# Altium schematic sheet Connectors.SchDoc
size B; SheetNumber: 2; SheetTotal: 2
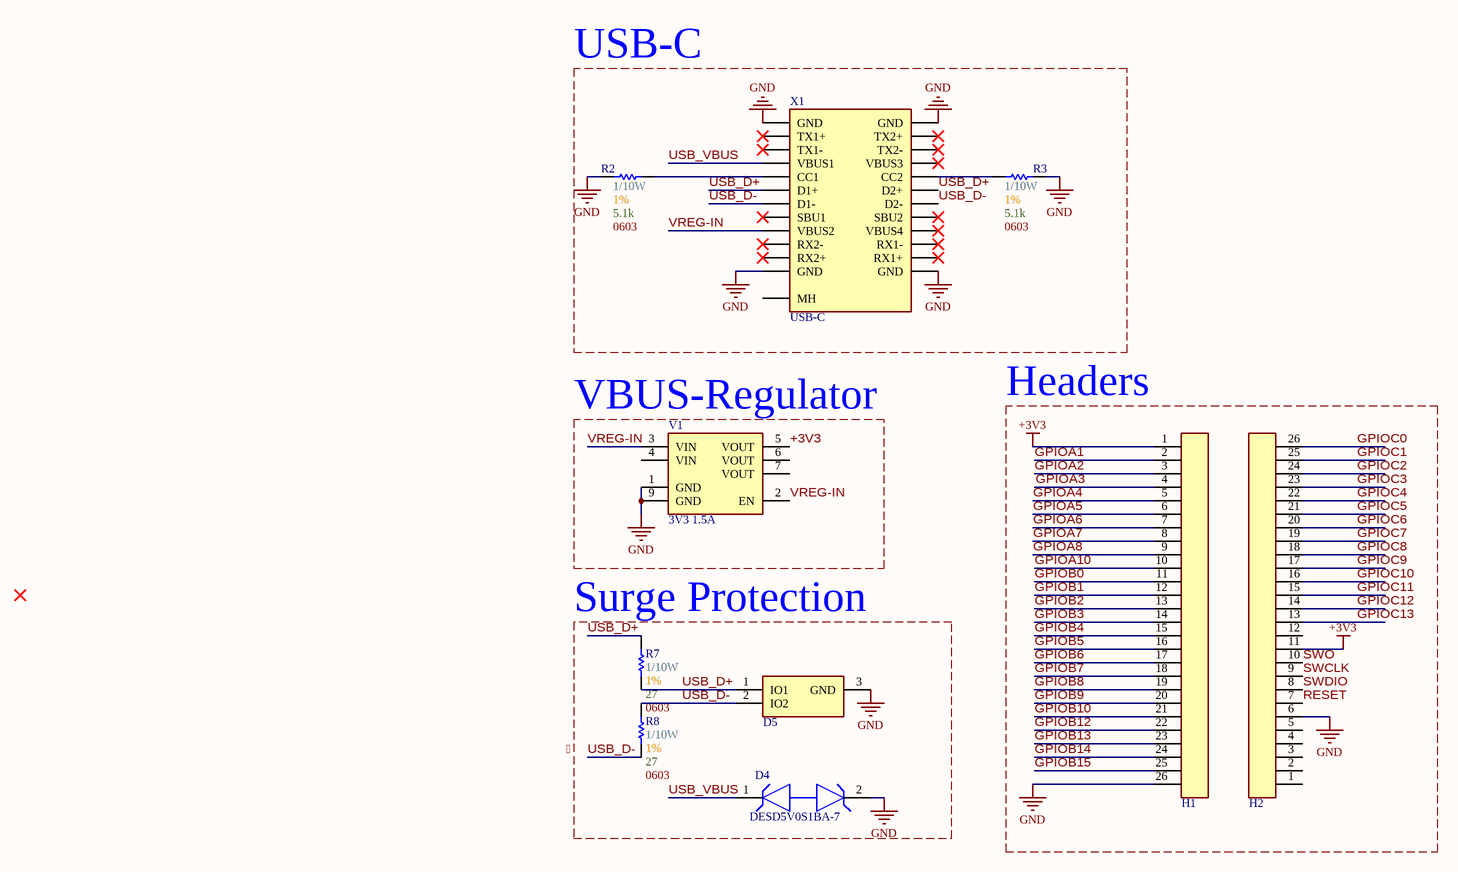
[diagram p0: Connectors.SchDoc]

## Parts
D4  DESD5V0S1BA-7  [FP-SOD323-MFG]
D5  TPD2E2U06QDBZRQ1  [SOT95P237X95-3N]  (value not drawn)
H1  1x26 Header  [[Header] 1x26 Male]  (value not drawn)
H2  1x26 Header  [[Header] 1x26 Male]  (value not drawn)
R2  Wattage: 1/10W  Tolerance: 1%  Resistance: 5.1k  Size Package: 0603  [[Res] SMD 0603]  (hidden comment: [5.1k] SMD 0603 1% 1/10W)
R3  Wattage: 1/10W  Tolerance: 1%  Resistance: 5.1k  Size Package: 0603  [[Res] SMD 0603]  (hidden comment: [5.1k] SMD 0603 1% 1/10W)
R7  Wattage: 1/10W  Tolerance: 1%  Resistance: 27  Size Package: 0603  [[Res] SMD 0603]  (hidden comment: [27] SMD 0603 1% 1/10W)
R8  Wattage: 1/10W  Tolerance: 1%  Resistance: 27  Size Package: 0603  [[Res] SMD 0603]  (hidden comment: [27] SMD 0603 1% 1/10W)
V1  3V3 1.5A  [[Linear] 3V3 1.5A]
X1  USB-C  [[USB] USB-C Right-Angle]

## Blocks framed on the sheet
USB-C: R2 R3 X1
VBUS-Regulator: V1
Headers: H1 H2
Surge Protection: D4 D5 R7 R8

## Nets
+3V3: H1.1 H2.11 V1.5(VOUT)
GND: D4.2 D5.3(GND) H1.26 H2.6 R2.1 R3.2 V1.1(GND) V1.9(GND) X1.A1(GND) X1.A12(GND) X1.B1(GND) X1.B12(GND)
GPIOA1: H1.2
GPIOA2: H1.3
GPIOA3: H1.4
GPIOA4: H1.5
GPIOA5: H1.6
GPIOA6: H1.7
GPIOA7: H1.8
GPIOA8: H1.9
GPIOA10: H1.10
GPIOB0: H1.11
GPIOB1: H1.12
GPIOB2: H1.13
GPIOB3: H1.14
GPIOB4: H1.15
GPIOB5: H1.16
GPIOB6: H1.17
GPIOB7: H1.18
GPIOB8: H1.19
GPIOB9: H1.20
GPIOB10: H1.21
GPIOB12: H1.22
GPIOB13: H1.23
GPIOB14: H1.24
GPIOB15: H1.25
GPIOC0: H2.26
GPIOC1: H2.25
GPIOC2: H2.24
GPIOC3: H2.23
GPIOC4: H2.22
GPIOC5: H2.21
GPIOC6: H2.20
GPIOC7: H2.19
GPIOC8: H2.18
GPIOC9: H2.17
GPIOC10: H2.16
GPIOC11: H2.15
GPIOC12: H2.14
GPIOC13: H2.13
RESET: H2.7
SWCLK: H2.9
SWDIO: H2.8
SWO: H2.10
USB_D+: D5.1(IO1) R7.1 R7.2 X1.A6(D1+) X1.B6(D2+)
USB_D-: D5.2(IO2) R8.1 R8.2 X1.A7(D1-) X1.B7(D2-)
USB_VBUS: D4.1 X1.A4(VBUS1)
VREG-IN: V1.2(EN) V1.3(VIN) X1.A9(VBUS2)
NetR2_2: R2.2 X1.A5(CC1)
NetR3_1: R3.1 X1.B5(CC2)

Not connected (* = marked no-connect by the designer): H2 1 2 3 4 5 12; V1 4(VIN) 6(VOUT) 7(VOUT); X1 A2(TX1+)* A3(TX1-)* A8(SBU1)* A10(RX2-)* A11(RX2+)* B2(TX2+)* B3(TX2-)* B4(VBUS3)* B8(SBU2)* B9(VBUS4)* B10(RX1-)* B11(RX1+)* MH

## Notes on the sheet
- Labels drawn without touching a wire or pin: 

## Library data of the parts
D4 = CMP-12828-000011-1: TVS DIODE 5V 14V SOD323; Manufacturer: Diodes Inc; Capacitance: 35pF; Direction: Bidirectional; Breakdown Voltage: 5.5V; Number Of Channels: 1; Standoff Height: 0.05mm; Max Junction Temp: +150°C; Peak Pulse Current: 12A; Value: 35pF; Peak Pulse Power: 130W; ComponentLink2Description: Datasheet; Manufacturer Part Number: DESD5V0S1BA-7; Mouser Description: TVS Diodes / ESD Suppressors Low Cap BI TVS Diode 130W 12A 200mW; Digikey Description: TVS DIODE 5V 14V SOD323; Temperature: -65°C to +150°C; Clamping Voltage: 14V; Device Class L2: TVS Diodes; Temperature Range Low: -65°C; Octopart: https://octopart.com/desd5v0s1ba-7-diodes+inc.-23272867; Lead Free: Yes; Package: SOD323; Temperature Range High: +150°C; Automotive: No; Device Class L1: Circuit Protection; RoHS: TRUE; Height: 1.2mm; Reverse Standoff Voltage: 5V; Category: Diode; Device Class L3: unset; ComponentLink2URL: https://www.diodes.com/assets/Datasheets/ds31275.pdf
D5 = CMP-018-000010-3: USB ESD Protection; Manufacturer_Name: Texas Instruments; Arrow Price/Stock: https://www.arrow.com/en/products/tpd2e2u06qdbzrq1/texas-instruments?region=nac; Datasheet Link: http://www.ti.com/lit/gpn/tpd2e2u06-q1; Arrow Part Number: TPD2E2U06QDBZRQ1; Design Item ID: TPD2E2U06QDBZRQ1; Mouser Price/Stock: https://www.mouser.co.uk/ProductDetail/Texas-Instruments/TPD2E2U06QDBZRQ1?qs=ADSrZYdIRCdCCkTjX0u0BA%3D%3D; Mouser Part Number: 595-TPD2E2U06QDBZRQ1; Source: SamacSys.SchLib; Manufacturer_Part_Number: TPD2E2U06QDBZRQ1; Height: 0.95mm
H1 H2 = [Header] 1x26 Male: 2.54mm pitch
R2 R3 = [5.1k] SMD 0603 1% 1/10W: RC0603FR-075K1L; Supplier 1: DigiKey; Supplier Part Number 1: 311-5.10KHRCT-ND
R7 R8 = [27] SMD 0603 1% 1/10W: MCT06030C2709FP500; Supplier 1: DigiKey; Supplier Part Number 1: 749-1631-1-ND
V1 = [Linear] 3V3 1.5A: AP7362A-33SP-13; Supplier 1: DigiKey; Supplier Part Number 1: AP7362A-33SP-13DICT-ND
X1 = [USB] Type-C Right-Angle: Supplier 1: DigiKey; Supplier Part Number 1: 670-3104-1-ND